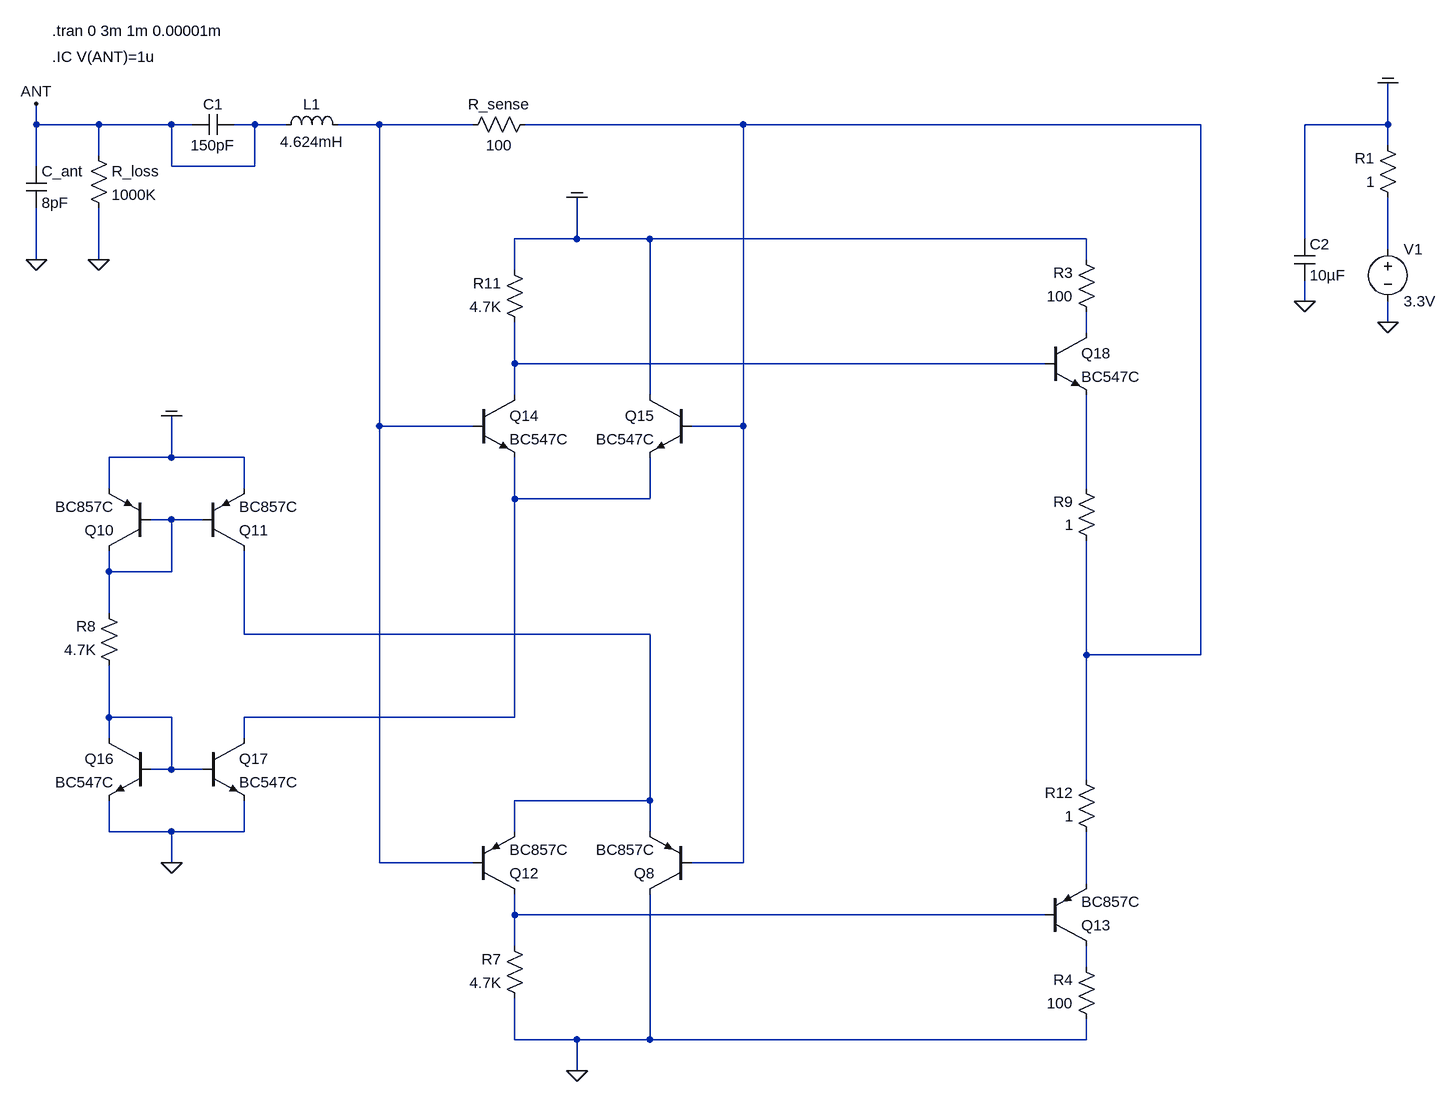
[diagram p0: schematic 2020_current_sense_comparator_npn_v06.asc]
2020_current_sense_comparator_npn_v06.asc, the LTspice schematic file:
Version 4
SHEET 1 3920 3748
WIRE -832 480 -832 448
WIRE -736 480 -832 480
WIRE -624 480 -736 480
WIRE -592 480 -624 480
WIRE -496 480 -528 480
WIRE -448 480 -496 480
WIRE -304 480 -368 480
WIRE -160 480 -304 480
WIRE 256 480 -80 480
WIRE 960 480 256 480
WIRE 1248 480 1248 416
WIRE 1248 480 1120 480
WIRE 1248 512 1248 480
WIRE -736 528 -736 480
WIRE -832 544 -832 480
WIRE -624 544 -624 480
WIRE -496 544 -496 480
WIRE -496 544 -624 544
WIRE 0 656 0 592
WIRE 0 656 -96 656
WIRE 112 656 0 656
WIRE 784 656 112 656
WIRE 1120 656 1120 480
WIRE 1248 672 1248 592
WIRE -832 688 -832 608
WIRE -736 688 -736 608
WIRE 784 688 784 656
WIRE -96 704 -96 656
WIRE 1120 752 1120 720
WIRE 1248 784 1248 752
WIRE 784 800 784 768
WIRE -96 848 -96 784
WIRE 720 848 -96 848
WIRE -96 896 -96 848
WIRE 112 896 112 656
WIRE -304 944 -304 480
WIRE -160 944 -304 944
WIRE 256 944 256 480
WIRE 256 944 176 944
WIRE -624 992 -624 928
WIRE -624 992 -720 992
WIRE -512 992 -624 992
WIRE -720 1040 -720 992
WIRE -512 1040 -512 992
WIRE 784 1040 784 896
WIRE -96 1056 -96 992
WIRE 112 1056 112 992
WIRE 112 1056 -96 1056
WIRE -624 1088 -656 1088
WIRE -576 1088 -624 1088
WIRE -720 1168 -720 1136
WIRE -624 1168 -624 1088
WIRE -624 1168 -720 1168
WIRE -720 1232 -720 1168
WIRE -512 1264 -512 1136
WIRE 112 1264 -512 1264
WIRE 784 1296 784 1120
WIRE 960 1296 960 480
WIRE 960 1296 784 1296
WIRE -720 1392 -720 1312
WIRE -624 1392 -720 1392
WIRE -96 1392 -96 1056
WIRE -96 1392 -512 1392
WIRE -720 1424 -720 1392
WIRE -512 1424 -512 1392
WIRE -624 1472 -624 1392
WIRE -624 1472 -656 1472
WIRE -576 1472 -624 1472
WIRE 784 1488 784 1296
WIRE 112 1520 112 1264
WIRE 112 1520 -96 1520
WIRE -720 1568 -720 1520
WIRE -624 1568 -720 1568
WIRE -512 1568 -512 1520
WIRE -512 1568 -624 1568
WIRE -96 1568 -96 1520
WIRE 112 1568 112 1520
WIRE -624 1616 -624 1568
WIRE -304 1616 -304 944
WIRE -160 1616 -304 1616
WIRE 256 1616 256 944
WIRE 256 1616 176 1616
WIRE 784 1648 784 1568
WIRE -96 1696 -96 1664
WIRE 720 1696 -96 1696
WIRE -96 1744 -96 1696
WIRE 784 1776 784 1744
WIRE -96 1888 -96 1824
WIRE 0 1888 -96 1888
WIRE 112 1888 112 1664
WIRE 112 1888 0 1888
WIRE 784 1888 784 1856
WIRE 784 1888 112 1888
WIRE 0 1936 0 1888
FLAG 1248 784 0
FLAG 1248 416 COM
FLAG -832 688 0
FLAG -832 448 ANT
FLAG -736 688 0
FLAG 1120 752 0
FLAG 0 1936 0
FLAG -624 928 COM
FLAG -624 1616 0
FLAG 0 592 COM
SYMBOL voltage 1248 656 R0
WINDOW 123 0 0 Left 0
WINDOW 39 0 0 Left 0
SYMATTR InstName V1
SYMATTR Value 3.3V
SYMBOL ind -464 496 R270
WINDOW 0 32 56 VTop 2
WINDOW 3 5 56 VBottom 2
SYMATTR InstName L1
SYMATTR Value 4.624mH
SYMATTR SpiceLine Rser=66 Rpar=10Meg Cpar=1.216pF
SYMBOL cap -848 544 R0
SYMATTR InstName C_ant
SYMATTR Value 8pF
SYMBOL res -752 512 R0
SYMATTR InstName R_loss
SYMATTR Value 1000K
SYMBOL res -64 464 R90
WINDOW 0 0 56 VBottom 2
WINDOW 3 32 56 VTop 2
SYMATTR InstName R_sense
SYMATTR Value 100
SYMBOL res 1264 608 R180
WINDOW 0 36 76 Left 2
WINDOW 3 36 40 Left 2
SYMATTR InstName R1
SYMATTR Value 1
SYMBOL cap 1104 656 R0
SYMATTR InstName C2
SYMATTR Value 10µF
SYMBOL cap -528 464 R90
WINDOW 0 0 32 VBottom 2
WINDOW 3 32 32 VTop 2
SYMATTR InstName C1
SYMATTR Value 150pF
SYMBOL pnp 176 1664 R180
SYMATTR InstName Q8
SYMATTR Value BC857C
SYMBOL pnp -656 1136 R180
SYMATTR InstName Q10
SYMATTR Value BC857C
SYMBOL pnp -576 1136 M180
SYMATTR InstName Q11
SYMATTR Value BC857C
SYMBOL pnp -160 1664 M180
SYMATTR InstName Q12
SYMATTR Value BC857C
SYMBOL res -80 1840 R180
WINDOW 0 36 76 Left 2
WINDOW 3 36 40 Left 2
SYMATTR InstName R7
SYMATTR Value 4.7K
SYMBOL res -704 1328 R180
WINDOW 0 36 76 Left 2
WINDOW 3 36 40 Left 2
SYMATTR InstName R8
SYMATTR Value 4.7K
SYMBOL pnp 720 1744 M180
SYMATTR InstName Q13
SYMATTR Value BC857C
SYMBOL npn -160 896 R0
SYMATTR InstName Q14
SYMATTR Value BC547C
SYMBOL npn 176 896 M0
SYMATTR InstName Q15
SYMATTR Value BC547C
SYMBOL npn -656 1424 M0
SYMATTR InstName Q16
SYMATTR Value BC547C
SYMBOL npn -576 1424 R0
SYMATTR InstName Q17
SYMATTR Value BC547C
SYMBOL res -80 800 R180
WINDOW 0 36 76 Left 2
WINDOW 3 36 40 Left 2
SYMATTR InstName R11
SYMATTR Value 4.7K
SYMBOL npn 720 800 R0
SYMATTR InstName Q18
SYMATTR Value BC547C
SYMBOL res 800 1136 R180
WINDOW 0 36 76 Left 2
WINDOW 3 36 40 Left 2
SYMATTR InstName R9
SYMATTR Value 1
SYMBOL res 800 1584 R180
WINDOW 0 36 76 Left 2
WINDOW 3 36 40 Left 2
SYMATTR InstName R12
SYMATTR Value 1
SYMBOL res 800 784 R180
WINDOW 0 36 76 Left 2
WINDOW 3 36 40 Left 2
SYMATTR InstName R3
SYMATTR Value 100
SYMBOL res 800 1872 R180
WINDOW 0 36 76 Left 2
WINDOW 3 36 40 Left 2
SYMATTR InstName R4
SYMATTR Value 100
TEXT -808 336 Left 2 !.tran 0 3m 1m 0.00001m
TEXT -808 376 Left 2 !.IC V(ANT)=1u

The netlist it stands for:
* 2020_current_sense_comparator_npn_v06.asc
V1 N003 0 3.3V
L1 ANT N001 4.624mH Rser=66 Rpar=10Meg Cpar=1.216pF
C_ant ANT 0 8pF
R_loss ANT 0 1000K
R_sense N002 N001 100
R1 N003 COM 1
C2 COM 0 10µF
C1 ANT ANT 150pF
Q8 0 N002 N009 0 BC857C
Q10 N008 N008 COM 0 BC857C
Q11 N009 N008 COM 0 BC857C
Q12 N012 N001 N009 0 BC857C
R7 0 N012 4.7K
R8 N010 N008 4.7K
Q13 N013 N012 N011 0 BC857C
Q14 N005 N001 N007 0 BC547C
Q15 COM N002 N007 0 BC547C
Q16 N010 N010 0 0 BC547C
Q17 N007 N010 0 0 BC547C
R11 N005 COM 4.7K
Q18 N004 N005 N006 0 BC547C
R9 N002 N006 1
R12 N011 N002 1
R3 N004 COM 100
R4 0 N013 100
.model NPN NPN
.model PNP PNP
.lib standard.bjt
.tran 0 3m 1m 0.00001m
.IC V(ANT)=1u
.backanno
.end